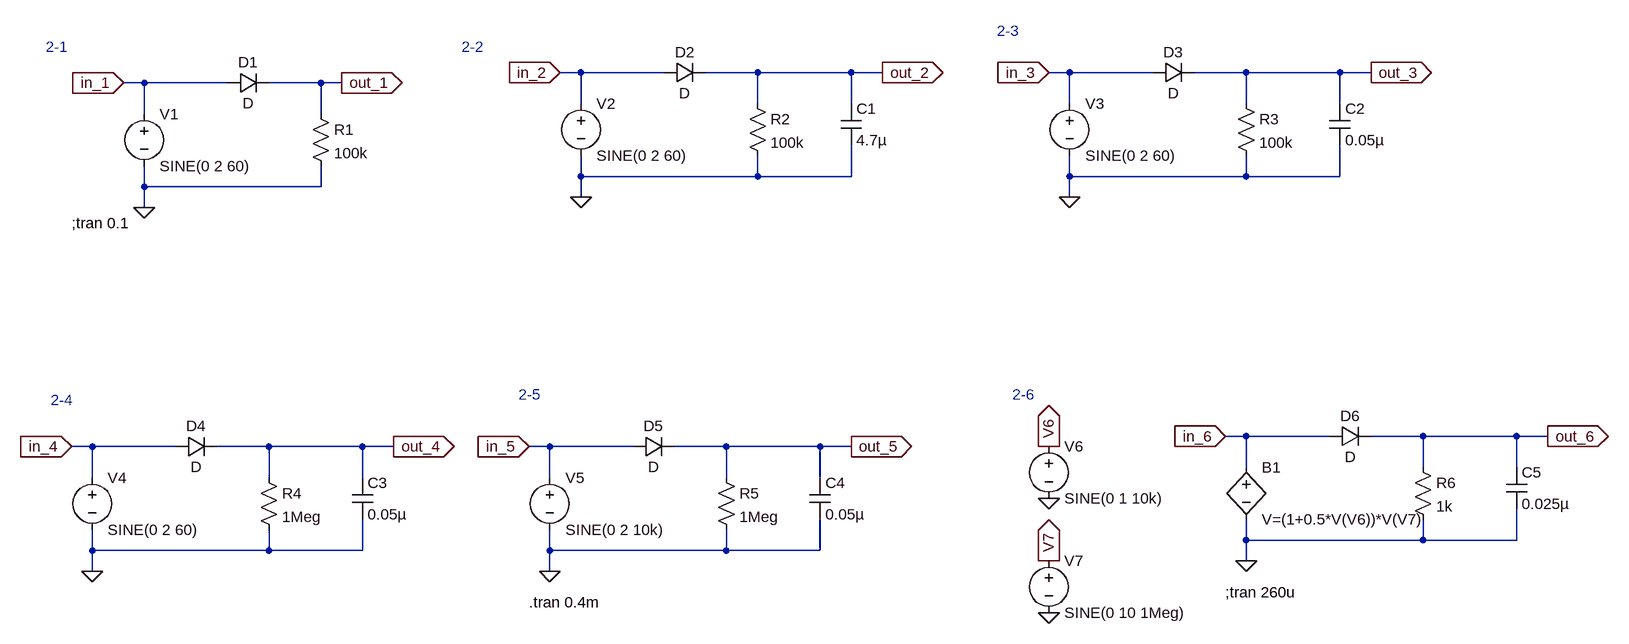
[diagram p0: schematic rectifier.asc]
rectifier.asc, the LTspice schematic file:
Version 4
SHEET 1 2272 1076
WIRE 656 64 624 64
WIRE 784 64 656 64
WIRE 928 64 848 64
WIRE 1072 64 928 64
WIRE 1120 64 1072 64
WIRE 1408 64 1376 64
WIRE 1536 64 1408 64
WIRE 1680 64 1600 64
WIRE 1824 64 1680 64
WIRE 1872 64 1824 64
WIRE -16 80 -48 80
WIRE 112 80 -16 80
WIRE 256 80 176 80
WIRE 288 80 256 80
WIRE 656 112 656 64
WIRE 928 112 928 64
WIRE 1072 112 1072 64
WIRE 1408 112 1408 64
WIRE 1680 112 1680 64
WIRE 1824 112 1824 64
WIRE -16 128 -16 80
WIRE 256 128 256 80
WIRE 656 224 656 192
WIRE 928 224 928 192
WIRE 928 224 656 224
WIRE 1072 224 1072 176
WIRE 1072 224 928 224
WIRE 1408 224 1408 192
WIRE 1680 224 1680 192
WIRE 1680 224 1408 224
WIRE 1824 224 1824 176
WIRE 1824 224 1680 224
WIRE -16 240 -16 208
WIRE 256 240 256 208
WIRE 256 240 -16 240
WIRE 656 256 656 224
WIRE 1408 256 1408 224
WIRE -16 272 -16 240
WIRE 1680 624 1648 624
WIRE 1808 624 1680 624
WIRE 1952 624 1872 624
WIRE 2096 624 1952 624
WIRE 2144 624 2096 624
WIRE -96 640 -128 640
WIRE 32 640 -96 640
WIRE 176 640 96 640
WIRE 320 640 176 640
WIRE 368 640 320 640
WIRE 608 640 576 640
WIRE 736 640 608 640
WIRE 880 640 800 640
WIRE 1024 640 880 640
WIRE 1072 640 1024 640
WIRE 1680 672 1680 624
WIRE 1952 672 1952 624
WIRE 2096 672 2096 624
WIRE -96 688 -96 640
WIRE 176 688 176 640
WIRE 320 688 320 640
WIRE 608 688 608 640
WIRE 880 688 880 640
WIRE 1024 688 1024 640
WIRE 1680 784 1680 752
WIRE 1952 784 1952 752
WIRE 1952 784 1680 784
WIRE 2096 784 2096 736
WIRE 2096 784 1952 784
WIRE -96 800 -96 768
WIRE 176 800 176 768
WIRE 176 800 -96 800
WIRE 320 800 320 752
WIRE 320 800 176 800
WIRE 608 800 608 768
WIRE 880 800 880 768
WIRE 880 800 608 800
WIRE 1024 800 1024 752
WIRE 1024 800 880 800
WIRE 1680 816 1680 784
WIRE -96 832 -96 800
WIRE 608 832 608 800
FLAG -16 272 0
FLAG -48 80 in_1
IOPIN -48 80 In
FLAG 288 80 out_1
IOPIN 288 80 Out
FLAG 656 256 0
FLAG 624 64 in_2
IOPIN 624 64 In
FLAG 1120 64 out_2
IOPIN 1120 64 Out
FLAG 1408 256 0
FLAG 1376 64 in_3
IOPIN 1376 64 In
FLAG 1872 64 out_3
IOPIN 1872 64 Out
FLAG -96 832 0
FLAG -128 640 in_4
IOPIN -128 640 In
FLAG 368 640 out_4
IOPIN 368 640 Out
FLAG 608 832 0
FLAG 576 640 in_5
IOPIN 576 640 In
FLAG 1072 640 out_5
IOPIN 1072 640 Out
FLAG 1680 816 0
FLAG 1648 624 in_6
IOPIN 1648 624 In
FLAG 2144 624 out_6
IOPIN 2144 624 Out
FLAG 1376 896 0
FLAG 1376 720 0
FLAG 1376 640 V6
IOPIN 1376 640 Out
FLAG 1376 816 V7
IOPIN 1376 816 Out
SYMBOL voltage -16 112 R0
WINDOW 123 0 0 Left 0
WINDOW 39 0 0 Left 0
SYMATTR InstName V1
SYMATTR Value SINE(0 2 60)
SYMBOL diode 112 96 R270
WINDOW 0 32 32 VTop 2
WINDOW 3 0 32 VBottom 2
SYMATTR InstName D1
SYMBOL res 240 112 R0
SYMATTR InstName R1
SYMATTR Value 100k
SYMBOL voltage 656 96 R0
WINDOW 123 0 0 Left 0
WINDOW 39 0 0 Left 0
SYMATTR InstName V2
SYMATTR Value SINE(0 2 60)
SYMBOL diode 784 80 R270
WINDOW 0 32 32 VTop 2
WINDOW 3 0 32 VBottom 2
SYMATTR InstName D2
SYMBOL res 912 96 R0
SYMATTR InstName R2
SYMATTR Value 100k
SYMBOL cap 1056 112 R0
SYMATTR InstName C1
SYMATTR Value 4.7µ
SYMBOL voltage 1408 96 R0
WINDOW 123 0 0 Left 0
WINDOW 39 0 0 Left 0
SYMATTR InstName V3
SYMATTR Value SINE(0 2 60)
SYMBOL diode 1536 80 R270
WINDOW 0 32 32 VTop 2
WINDOW 3 0 32 VBottom 2
SYMATTR InstName D3
SYMBOL res 1664 96 R0
SYMATTR InstName R3
SYMATTR Value 100k
SYMBOL cap 1808 112 R0
SYMATTR InstName C2
SYMATTR Value 0.05µ
SYMBOL voltage -96 672 R0
WINDOW 123 0 0 Left 0
WINDOW 39 0 0 Left 0
SYMATTR InstName V4
SYMATTR Value SINE(0 2 60)
SYMBOL diode 32 656 R270
WINDOW 0 32 32 VTop 2
WINDOW 3 0 32 VBottom 2
SYMATTR InstName D4
SYMBOL res 160 672 R0
SYMATTR InstName R4
SYMATTR Value 1Meg
SYMBOL cap 304 688 R0
SYMATTR InstName C3
SYMATTR Value 0.05µ
SYMBOL voltage 608 672 R0
WINDOW 123 0 0 Left 0
WINDOW 39 0 0 Left 0
SYMATTR InstName V5
SYMATTR Value SINE(0 2 10k)
SYMBOL diode 736 656 R270
WINDOW 0 32 32 VTop 2
WINDOW 3 0 32 VBottom 2
SYMATTR InstName D5
SYMBOL res 864 672 R0
SYMATTR InstName R5
SYMATTR Value 1Meg
SYMBOL cap 1008 688 R0
SYMATTR InstName C4
SYMATTR Value 0.05µ
SYMBOL diode 1808 640 R270
WINDOW 0 32 32 VTop 2
WINDOW 3 0 32 VBottom 2
SYMATTR InstName D6
SYMBOL res 1936 656 R0
SYMATTR InstName R6
SYMATTR Value 1k
SYMBOL cap 2080 672 R0
SYMATTR InstName C5
SYMATTR Value 0.025µ
SYMBOL voltage 1376 624 R0
WINDOW 123 0 0 Left 0
WINDOW 39 0 0 Left 0
SYMATTR InstName V6
SYMATTR Value SINE(0 1 10k)
SYMBOL voltage 1376 800 R0
WINDOW 123 0 0 Left 0
WINDOW 39 0 0 Left 0
SYMATTR InstName V7
SYMATTR Value SINE(0 10 1Meg)
SYMBOL bv 1680 656 R0
SYMATTR InstName B1
SYMATTR Value V=(1+0.5*V(V6))*V(V7)
TEXT -128 296 Left 2 !;tran 0.1
TEXT -168 24 Left 2 ;2-1
TEXT 472 24 Left 2 ;2-2
TEXT 1296 0 Left 2 ;2-3
TEXT -160 568 Left 2 ;2-4
TEXT 560 560 Left 2 ;2-5
TEXT 1320 560 Left 2 ;2-6
TEXT 1648 864 Left 2 !;tran 260u
TEXT 576 880 Left 2 !.tran 0.4m

The netlist it stands for:
* rectifier.asc
V1 in_1 0 SINE(0 2 60)
D1 in_1 out_1 D
R1 out_1 0 100k
V2 in_2 0 SINE(0 2 60)
D2 in_2 out_2 D
R2 out_2 0 100k
C1 out_2 0 4.7µ
V3 in_3 0 SINE(0 2 60)
D3 in_3 out_3 D
R3 out_3 0 100k
C2 out_3 0 0.05µ
V4 in_4 0 SINE(0 2 60)
D4 in_4 out_4 D
R4 out_4 0 1Meg
C3 out_4 0 0.05µ
V5 in_5 0 SINE(0 2 10k)
D5 in_5 out_5 D
R5 out_5 0 1Meg
C4 out_5 0 0.05µ
D6 in_6 out_6 D
R6 out_6 0 1k
C5 out_6 0 0.025µ
V6 V6 0 SINE(0 1 10k)
V7 V7 0 SINE(0 10 1Meg)
B1 in_6 0 V=(1+0.5*V(V6))*V(V7)
.model D D
.lib standard.dio
;tran 0.1
* 2-1
* 2-2
* 2-3
* 2-4
* 2-5
* 2-6
;tran 260u
.tran 0.4m
.backanno
.end